# Altium schematic sheet SensorThing v1.0.SchDoc: SensorThing
size A3; ApprovedBy: Behnam Shakibafar; DrawnBy: Behnam Shakibafar; Revision: 1.0; SheetNumber: 1; SheetTotal: 1
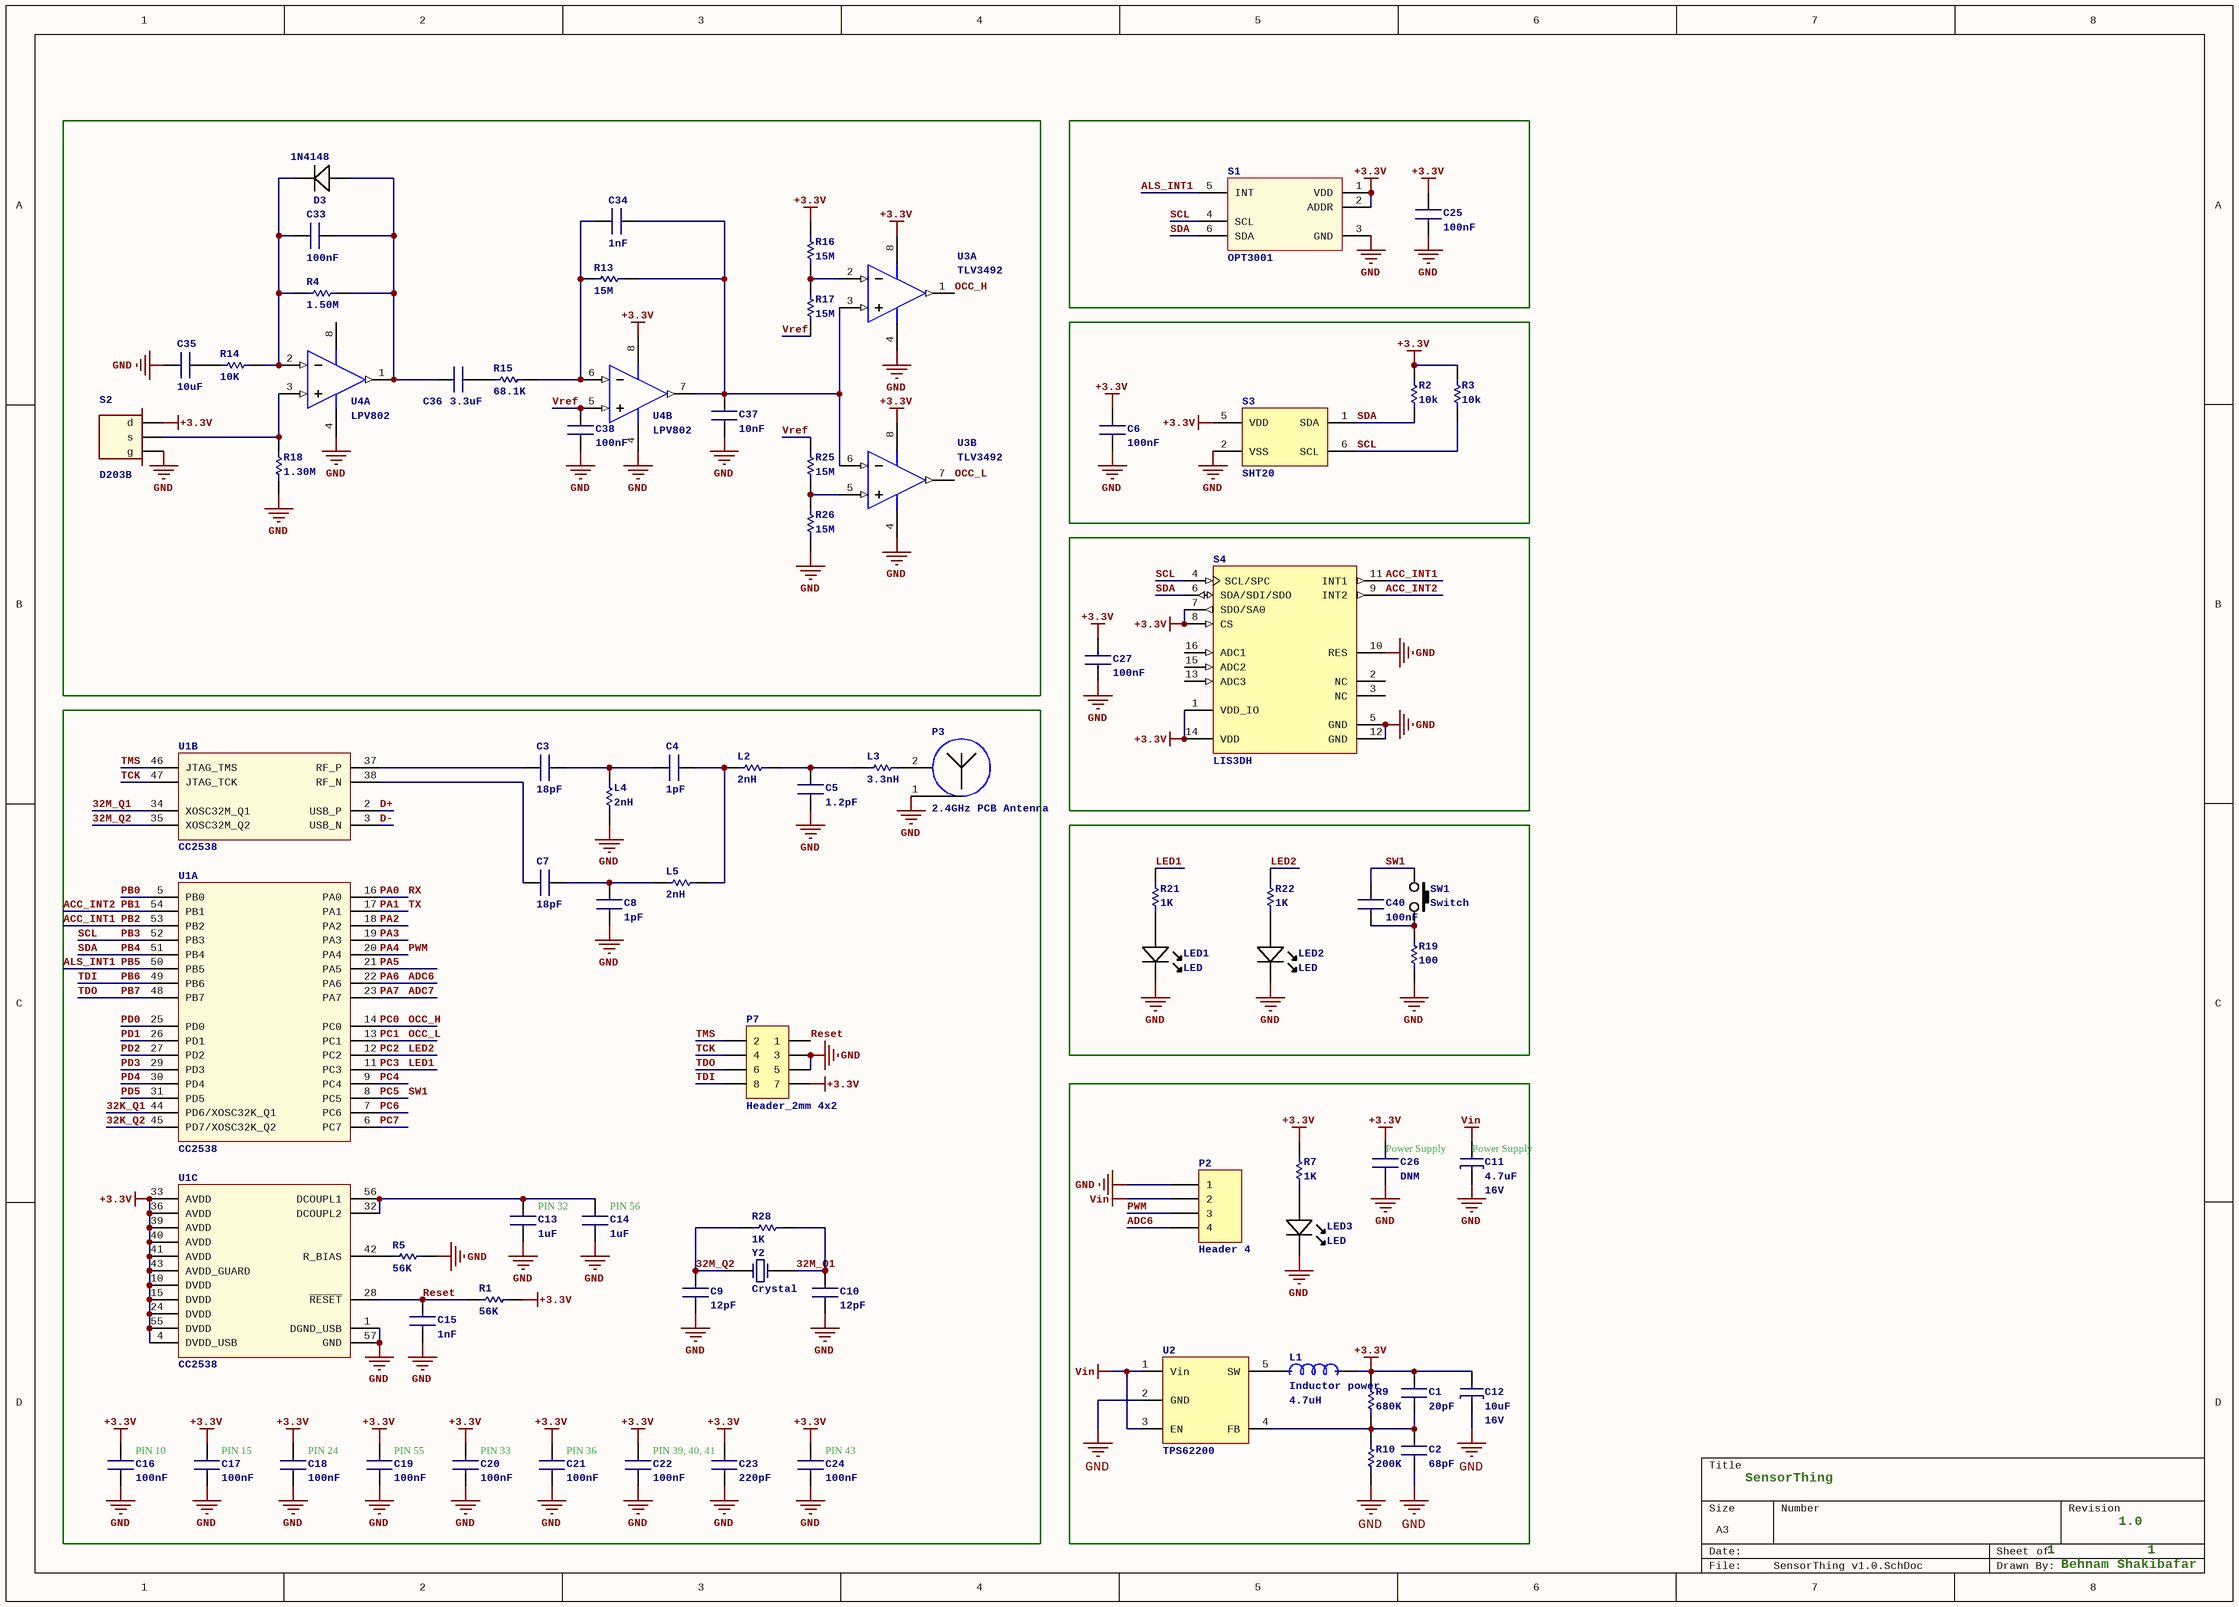
[diagram p0: SensorThing v1.0.SchDoc]

## Parts
C1  Capacity: 20pF  [CAP 0603]  (hidden comment: Cap)
C2  Capacity: 68pF  [CAP 0603]  (hidden comment: Cap)
C3  Capacity: 18pF  [CAP 0603]  (hidden comment: Cap)
C4  Capacity: 1pF  [CAP 0603]  (hidden comment: Cap)
C5  Capacity: 1.2pF  [CAP 0603]  (hidden comment: Cap)
C6  Capacity: 100nF  [CAP 0603]  (hidden comment: Cap)
C7  Capacity: 18pF  [CAP 0603]  (hidden comment: Cap)
C8  Capacity: 1pF  [CAP 0603]  (hidden comment: Cap)
C9  Capacity: 12pF  [CAP 0603]  (hidden comment: Cap)
C10  Capacity: 12pF  [CAP 0603]  (hidden comment: Cap)
C11  Capacity: 4.7uF  Voltage: 16V  [CAP A]  (hidden comment: Cap pol)
C12  Capacity: 10uF  Voltage: 16V  [CAP A]  (hidden comment: Cap pol)
C13  Capacity: 1uF  [CAP 0603]  (hidden comment: Cap)
C14  Capacity: 1uF  [CAP 0603]  (hidden comment: Cap)
C15  Capacity: 1nF  [CAP 0603]  (hidden comment: Cap)
C16  Capacity: 100nF  [CAP 0603]  (hidden comment: Cap)
C17  Capacity: 100nF  [CAP 0603]  (hidden comment: Cap)
C18  Capacity: 100nF  [CAP 0603]  (hidden comment: Cap)
C19  Capacity: 100nF  [CAP 0603]  (hidden comment: Cap)
C20  Capacity: 100nF  [CAP 0603]  (hidden comment: Cap)
C21  Capacity: 100nF  [CAP 0603]  (hidden comment: Cap)
C22  Capacity: 100nF  [CAP 0603]  (hidden comment: Cap)
C23  Capacity: 220pF  [CAP 0603]  (hidden comment: Cap)
C24  Capacity: 100nF  [CAP 0603]  (hidden comment: Cap)
C25  Capacity: 100nF  [CAP 0603]  (hidden comment: Cap)
C26  Capacity: DNM  [CAP 0603]  (hidden comment: Cap)
C27  Capacity: 100nF  [CAP 0603]  (hidden comment: Cap)
C33  Capacity: 100nF  [CAP 0603]  (hidden comment: Cap)
C34  Capacity: 1nF  [CAP 0603]  (hidden comment: Cap)
C35  Capacity: 10uF  [CAP 0603]  (hidden comment: Cap)
C36  Capacity: 3.3uF  [CAP 0603]  (hidden comment: Cap)
C37  Capacity: 10nF  [CAP 0603]  (hidden comment: Cap)
C38  Capacity: 100nF  [CAP 0603]  (hidden comment: Cap)
C40  Capacity: 100nF  [CAP 0603]  (hidden comment: Cap)
D3  1N4148  [SOD-523]
L1  Inductor power  value 4.7uH  [INDUCTOR 2520]
L2  Ohm: 2nH  [RES 0603]  (hidden comment: Res)
L3  Ohm: 3.3nH  [RES 0603]  (hidden comment: Res)
L4  Ohm: 2nH  [RES 0603]  (hidden comment: Res)
L5  Ohm: 2nH  [RES 0603]  (hidden comment: Res)
LED1  LED  [LED 0603]
LED2  LED  [LED 0603]
LED3  LED  [LED 0603]
P2  Header 4  [HDR1X4]
P3  2.4GHz PCB Antenna  [2.4 GHz Inverted F Antenna 1]
P7  Header_2mm 4x2  [Header_2mm 4x2]
R1  Ohm: 56K  [RES 0603]  (hidden comment: Res)
R2  Ohm: 10k  [RES 0603]  (hidden comment: Res)
R3  Ohm: 10k  [RES 0603]  (hidden comment: Res)
R4  Ohm: 1.50M  [RES 0603]  (hidden comment: Res)
R5  Ohm: 56K  [RES 0603]  (hidden comment: Res)
R7  Ohm: 1K  [RES 0603]  (hidden comment: Res)
R9  Ohm: 680K  [RES 0603]  (hidden comment: Res)
R10  Ohm: 200K  [RES 0603]  (hidden comment: Res)
R13  Ohm: 15M  [RES 0603]  (hidden comment: Res)
R14  Ohm: 10K  [RES 0603]  (hidden comment: Res)
R15  Ohm: 68.1K  [RES 0603]  (hidden comment: Res)
R16  Ohm: 15M  [RES 0603]  (hidden comment: Res)
R17  Ohm: 15M  [RES 0603]  (hidden comment: Res)
R18  Ohm: 1.30M  [RES 0603]  (hidden comment: Res)
R19  Ohm: 100  [RES 0603]  (hidden comment: Res)
R21  Ohm: 1K  [RES 0603]  (hidden comment: Res)
R22  Ohm: 1K  [RES 0603]  (hidden comment: Res)
R25  Ohm: 15M  [RES 0603]  (hidden comment: Res)
R26  Ohm: 15M  [RES 0603]  (hidden comment: Res)
R28  Ohm: 1K  [RES 0603]  (hidden comment: Res)
S1  OPT3001  [USON-6pin]
S2  D203B  [D203B]
S3  SHT20  [SHT20]
S4  LIS3DH  [LGA16-3X3X1_N]
SW1  Switch  [Switch Side-B3U]
U1  CC2538  [PVQFN56-CC2538]  (parts A,B,C of 3)
U2  TPS62200  [SOT23-5]
U3  TLV3492  [VSSOP 8-Pin]  (parts A,B of 2)
U4  LPV802  [VSSOP 8-Pin]  (parts A,B of 2)
Y2  Crystal  [Crystal 3225]

## Nets
+3.3V: C1.1 C6.1 C12.1 C16.1 C17.1 C18.1 C19.1 C20.1 C21.1 C22.1 C23.1 C24.1 C25.1 C26.1 C27.1 L1.2 P7.7 R1.2 R2.1 R3.1 R7.1 R9.1 R16.2 S1.1(VDD) S1.2(ADDR) S2.1(d) S3.5(VDD) S4.1(VDD_IO) S4.7(SDO/SA0) S4.8(CS) S4.14(VDD) U1.4(DVDD_USB) U1.10(DVDD) U1.15(DVDD) U1.24(DVDD) U1.33(AVDD) U1.36(AVDD) U1.39(AVDD) U1.40(AVDD) U1.41(AVDD) U1.43(AVDD_GUARD) U1.55(DVDD) U3.8(V+) U4.8(V+)
GND: C2.2 C5.2 C6.2 C8.2 C9.2 C10.2 C11.2 C12.2 C13.2 C14.2 C15.2 C16.2 C17.2 C18.2 C19.2 C20.2 C21.2 C22.2 C23.2 C24.2 C25.2 C26.2 C27.2 C35.2 C37.2 C38.2 L4.1 LED1.2 LED2.2 LED3.2 P2.1 P3.1 P7.3 P7.5 R5.2 R10.2 R18.1 R19.2 R26.1 S1.3(GND) S2.3(g) S3.2(VSS) S4.5(GND) S4.10(RES) S4.12(GND) U1.1(DGND_USB) U1.57(GND) U2.2(GND) U3.4 U4.4
Vin: C11.1 P2.2 U2.1(Vin) U2.3(EN)
32K_Q1: U1.44(PD6/XOSC32K_Q1)
32K_Q2: U1.45(PD7/XOSC32K_Q2)
32M_Q1: C10.1 R28.2 U1.34(XOSC32M_Q1) Y2.2
32M_Q2: C9.1 R28.1 U1.35(XOSC32M_Q2) Y2.1
ACC_INT1: S4.11(INT1) U1.53(PB2)  [also labelled PB2]
ACC_INT2: S4.9(INT2) U1.54(PB1)  [also labelled PB1]
ADC6: P2.4 U1.22(PA6)  [also labelled PA6]
ADC7: U1.23(PA7)  [also labelled PA7]
ALS_INT1: S1.5(INT) U1.50(PB5)  [also labelled PB5]
D+: U1.2(USB_P)
D-: U1.3(USB_N)
LED1: R21.1 U1.11(PC3)  [also labelled PC3]
LED2: R22.1 U1.12(PC2)  [also labelled PC2]
OCC_H: U1.14(PC0) U3.1  [also labelled PC0]
OCC_L: U1.13(PC1) U3.7  [also labelled PC1]
PA0: U1.16(PA0)  [also labelled RX]
PA1: U1.17(PA1)  [also labelled TX]
PA2: U1.18(PA2)
PA3: U1.19(PA3)
PA4: P2.3 U1.20(PA4)  [also labelled PWM]
PA5: U1.21(PA5)
PB0: U1.5(PB0)
PB3: R3.2 S1.4(SCL) S3.6(SCL) S4.4(SCL/SPC) U1.52(PB3)  [also labelled SCL]
PB4: R2.2 S1.6(SDA) S3.1(SDA) S4.6(SDA/SDI/SDO) U1.51(PB4)  [also labelled SDA]
PB6: P7.8 U1.49(PB6)  [also labelled TDI]
PB7: P7.6 U1.48(PB7)  [also labelled TDO]
PC4: U1.9(PC4)
PC5: C40.1 SW1.1 U1.8(PC5)  [also labelled SW1]
PC6: U1.7(PC6)
PC7: U1.6(PC7)
PD0: U1.25(PD0)
PD1: U1.26(PD1)
PD2: U1.27(PD2)
PD3: U1.29(PD3)
PD4: U1.30(PD4)
PD5: U1.31(PD5)
Reset: C15.1 P7.1 R1.1 U1.28(~{RESET})
TCK: P7.4 U1.47(JTAG_TCK)
TMS: P7.2 U1.46(JTAG_TMS)
Vref: C38.1 R17.1 R25.2 U4.5
NetC1_2: C1.2 C2.1 R9.2 R10.1 U2.4(FB)
NetC3_1: C3.1 C4.2 L4.2
NetC3_2: C3.2 U1.37(RF_P)
NetC4_1: C4.1 L2.2 L5.1
NetC5_1: C5.1 L2.1 L3.2
NetC7_1: C7.1 C8.1 L5.2
NetC7_2: C7.2 U1.38(RF_N)
NetC13_1: C13.1 C14.1 U1.32(DCOUPL2) U1.56(DCOUPL1)
NetC33_1: C33.1 D3.2 R4.1 R14.2 U4.2
NetC33_2: C33.2 C36.2 D3.1 R4.2 U4.1
NetC34_1: C34.1 R13.1 R15.2 U4.6
NetC34_2: C34.2 C37.1 R13.2 U3.3 U3.6 U4.7
NetC35_1: C35.1 R14.1
NetC36_1: C36.1 R15.1
NetC40_2: C40.2 R19.1 SW1.2
NetL1_1: L1.1 U2.5(SW)
NetL3_1: L3.1 P3.2
NetLED1_1: LED1.1 R21.2
NetLED2_1: LED2.1 R22.2
NetLED3_1: LED3.1 R7.2
NetR5_1: R5.1 U1.42(R_BIAS)
NetR16_1: R16.1 R17.2 U3.2
NetR18_2: R18.2 S2.2(s) U4.3
NetR25_1: R25.1 R26.2 U3.5

Not connected (* = marked no-connect by the designer): S4 2(NC) 3(NC) 13(ADC3) 15(ADC2) 16(ADC1)

## Notes on the sheet
- (near C26) Power Supply
- (near C11) Power Supply
- (near C13) PIN 32
- (near C14) PIN 56
- (near C16) PIN 10
- (near C17) PIN 15
- (near C18) PIN 24
- (near C19) PIN 55
- (near C20) PIN 33
- (near C21) PIN 36
- (near C23) PIN 39, 40, 41
- (near C24) PIN 43

## Library data of the parts
C1-C10 C13-C27 C33-C38 C40 = Cap: Voltage: 100V
D3 = Diode: Type: *
L2-L5 R1-R5 R7 R9 R10 R13-R19 R21 R22 R25 R26 R28 = Res: Resistor
LED1-LED3 = LED SMD
P2 = Header 4: Header, 4-Pin; LatestRevisionDate: 17-Jul-2002; LatestRevisionNote: Re-released for DXP Platform.; Publisher: Altium Limited
S2 = D203B PIR sensor
S4 = LIS3DH: MEMS digital output motion sensor: Ultra low-power high performance 3-axis nano accelerometer, -40 to +85°C, LGA-16 (3x3x1), Tray; Manufacturer: STMicroelectronics; DatasheetVersion: rev1, May-2010; PackageVersion: 2008; PackageReference: LGA16-3X3X1; PackageDescription: 16-Pin Land Grid Array, 3 x 3 x 1 mm Body, 0.5 mm Pitch; ComponentLink1Description: Manufacturer URL; ComponentLink1URL: http://www.st.com/; ComponentLink2Description: LIS3DH Datasheet; ComponentLink2URL: http://www.st.com/internet/com/TECHNICAL_RESOURCES/TECHNICAL_LITERATURE/DATASHEET/CD00274221.pdf; ComponentLink3Description: LIS3DH Web Page; ComponentLink3URL: http://www.st.com/internet/analog/product/250725.jsp
SW1 = Switch: micro Switch
U2 = TPS6220: NAND gate
Y2 = Xtal